# Altium project MCU099_LP-MSPM0L1306.PrjPcb (part 1 of 3)
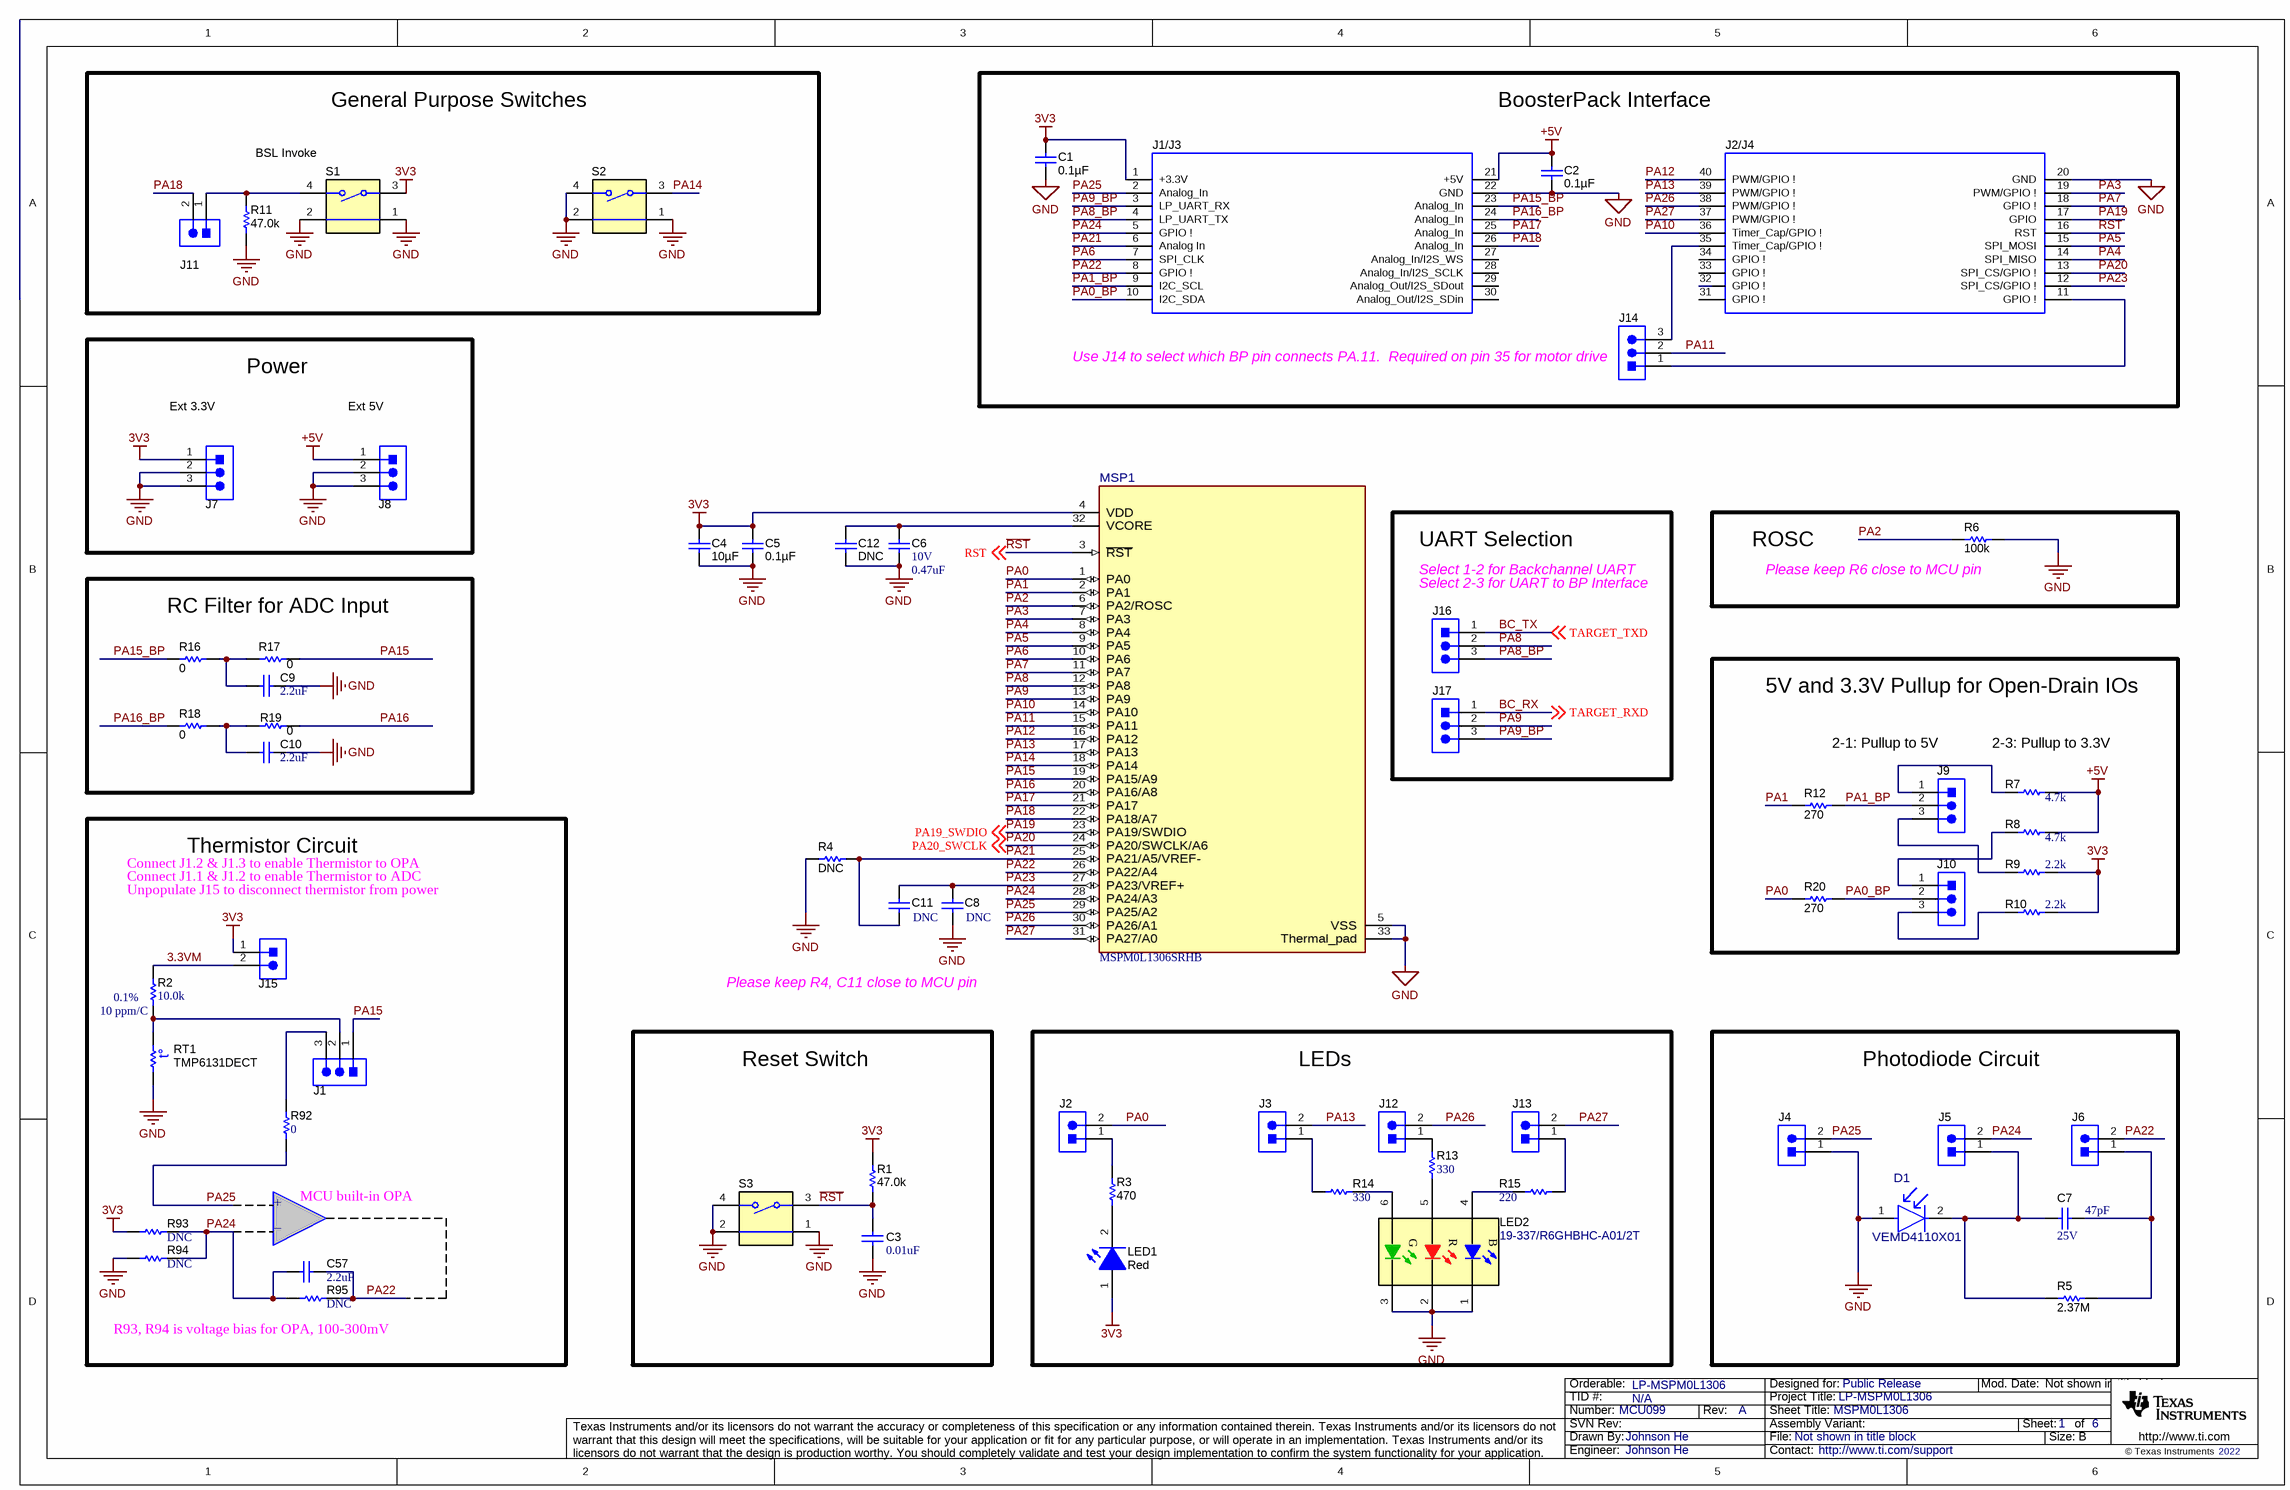
[diagram p0: MCU099_01_MSPM0L1306_Target_Device.SchDoc]
TID: N/A; TechSupport: http://www.ti.com/support; SCH_Rev: A; PRJ_Title: LP-MSPM0L1306; PRJ_Number: MCU099; PRJ_Engineer: Johnson He; PRJ_Customer: Public Release; PCB_Rev: A; PCB_Layout: Johnson He; EVM_orderable: LP-MSPM0L1306; CopyrightYear: 2022
6 sheets, 214 parts. Net scope: global (net labels, ports and power ports of the same name join across sheets).
Board file: MCU099_MSPM0L1306_PCB.PcbDoc
Sheets:
  MCU099_01_MSPM0L1306_Target_Device.SchDoc
  MCU099_02_XDS110_Debug_Probe.SchDoc
  MCU099_03_XDS110-ET_EnergyTrace.SchDoc
  MCU099_04_XDS110_Target_Interface.SchDoc
  MCU099_05_XDS110-ET_USB_Power.SchDoc
  MCU099_06_Hardware.SchDoc

## Sheet MCU099_01_MSPM0L1306_Target_Device.SchDoc: MSPM0L1306
size 431 x 279 mm; Date: Not shown in title block; ApprovedBy: Not shown in title block; CheckedBy: Not shown in title block; Author: Not shown in title block; CompanyName: Not shown in title block; DrawnBy: Johnson He; Engineer: Not shown in title block; Organization: Not shown in title block; Address1: Not shown in title block; Address2: Not shown in title block; Address3: Not shown in title block; Address4: Not shown in title block; DocumentNumber: 1; Revision: Use project parameter SCH_Rev; SheetNumber: 1; SheetTotal: 6; PageSetup: Record=PageOptions|CenterHorizontal=True|CenterVertical=True|PrintScale=1.00|XCorrection=1.00|YCorrection=1.00|PrintKind=0|BorderSize=5000000|LeftOffset=0|BottomOffset=0|Orientation=2|PaperLength=1000|PaperWidth=1000|Scale=100|PaperSource=15|PrintQuality=600|MediaType=1|DitherType=10|PaperKind=Letter|PrintScaleMode=1; CurrentTime: Not shown in title block; CurrentDate: Not shown in title block; Time: Not shown in title block; DocumentFullPathAndName: Not shown in title block; DocumentName: Not shown in title block; ModifiedDate: Not shown in title block; ImagePath: Not shown in title block

### Parts
C1  ValueDisplayed: 0.1µF  [0603]  (hidden comment: CL10A104KA8NNNC)
C2  ValueDisplayed: 0.1µF  [0603]  (hidden comment: CL10A104KA8NNNC)
C3  ValueDisplayed: 0.01uF  [0402]  (hidden comment: 885012205031)
C4  ValueDisplayed: 10µF  [0603]  (hidden comment: GRM188R61C106KAALD)
C5  ValueDisplayed: 0.1µF  [0603]  (hidden comment: CL10A104KA8NNNC)
C6  VDC_V: 10V  ValueDisplayed: 0.47uF  [0603]  (hidden comment: C0603C474K8PACTU)
C7  VDC_V: 25V  ValueDisplayed: 47pF  [0402]  (hidden comment: GRM1555C1E470JA01D)
C8  ValueDisplayed: DNC  [0603]  (hidden comment: C1608X5R1A105K080AC)  (no BOM)
C9  ValueDisplayed: 2.2uF  [0603]  (hidden comment: C0603C225K8PACTU)  (no BOM)
C10  ValueDisplayed: 2.2uF  [0603]  (hidden comment: C0603C225K8PACTU)  (no BOM)
C11  ValueDisplayed: DNC  [0603]  (hidden comment: C1608X5R1A105K080AC)  (no BOM)
C12  ValueDisplayed: DNC  [0603]  (hidden comment: CL10A104KA8NNNC)  (no BOM)
C57  ValueDisplayed: 2.2uF  [0603]  (hidden comment: C0603C225K8PACTU)  (no BOM)
D1  VEMD4110X01  [FP-VEMD4110X01_0805-MFG]
J1  PEC03SAAN  [CONN_PEC03SAAN]  (value not drawn)
J1/J3  SSQ-110-03-T-D  [BoosterPack_40pin_J1J3]  (value not drawn)
J2  TSW-102-07-G-S  [TSW-102-07-G-S]  (value not drawn)
J2/J4  SSQ-110-03-T-D  [BoosterPack_40pin_J2J4]  (value not drawn)
J3  TSW-102-07-G-S  [TSW-102-07-G-S]  (value not drawn)
J4  TSW-102-07-G-S  [TSW-102-07-G-S]  (value not drawn)
J5  TSW-102-07-G-S  [TSW-102-07-G-S]  (value not drawn)
J6  TSW-102-07-G-S  [TSW-102-07-G-S]  (value not drawn)
J7  PEC03SAAN  [PEC03SAAN_Launchpad_3V3]  (value not drawn)
J8  PEC03SAAN  [PEC03SAAN_Launchpad_5V0]  (value not drawn)
J9  PEC03SAAN  [CONN_PEC03SAAN]  (value not drawn)
J10  PEC03SAAN  [CONN_PEC03SAAN]  (value not drawn)
J11  TSW-102-07-G-S  [TSW-102-07-G-S]  (value not drawn)
J12  TSW-102-07-G-S  [TSW-102-07-G-S]  (value not drawn)
J13  TSW-102-07-G-S  [TSW-102-07-G-S]  (value not drawn)
J14  PEC03SAAN  [CONN_PEC03SAAN]  (value not drawn)
J15  90120-0122  [CONN_90120-0122]  (value not drawn)
J16  PEC03SAAN  [CONN_PEC03SAAN]  (value not drawn)
J17  PEC03SAAN  [CONN_PEC03SAAN]  (value not drawn)
LED1  value Red  [1111C_Red]  (hidden comment: BR1111C-TR)
LED2  19-337/R6GHBHC-A01/2T  [19-337_RGB]
MSP1  MSPM0L1306SRHB  [RHB0032N-MFG]
R1  ValueDisplayed: 47.0k  [0402]  (hidden comment: RC0402FR-0747KL)
R2  Tolerance_%: 0.1%  TempCo: 10 ppm/C  ValueDisplayed: 10.0k  [ERA3A]  (hidden comment: ERA3ARB103V)
R3  ValueDisplayed: 470  [0402]  (hidden comment: RC0402FR-07470RL)
R4  ValueDisplayed: DNC  [0603]  (hidden comment: MCT06030Z0000ZP500)  (no BOM)
R5  ValueDisplayed: 2.37M  [0603]  (hidden comment: CRCW06032M37FKEA)
R6  ValueDisplayed: 100k  [0402]  (hidden comment: RG1005P-104-B-T5)
R7  ValueDisplayed: 4.7k  [0603]  (hidden comment: RC0603JR-074K7L)
R8  ValueDisplayed: 4.7k  [0603]  (hidden comment: RC0603JR-074K7L)
R9  ValueDisplayed: 2.2k  [0603]  (hidden comment: RC0603JR-0710KL)
R10  ValueDisplayed: 2.2k  [0603]  (hidden comment: RC0603JR-0710KL)
R11  ValueDisplayed: 47.0k  [0402]  (hidden comment: RC0402FR-0747KL)
R12  ValueDisplayed: 270  [0603]  (hidden comment: RC0603JR-07270RL)
R13  ValueDisplayed: 330  [0402]  (hidden comment: CRCW0402330RJNED)
R14  ValueDisplayed: 330  [0402]  (hidden comment: CRCW0402330RJNED)
R15  ValueDisplayed: 220  [0402]  (hidden comment: CRCW0402220RJNED)
R16  ValueDisplayed: 0  [0603]  (hidden comment: MCT06030Z0000ZP500)
R17  ValueDisplayed: 0  [0603]  (hidden comment: MCT06030Z0000ZP500)
R18  ValueDisplayed: 0  [0603]  (hidden comment: MCT06030Z0000ZP500)
R19  ValueDisplayed: 0  [0603]  (hidden comment: MCT06030Z0000ZP500)
R20  ValueDisplayed: 270  [0603]  (hidden comment: RC0603JR-07270RL)
R92  ValueDisplayed: 0  [0603]  (hidden comment: RC0603JR-070RL)
R93  ValueDisplayed: DNC  [0603]  (hidden comment: RC0603JR-070RL)  (no BOM)
R94  ValueDisplayed: DNC  [0603]  (hidden comment: RC0603JR-070RL)  (no BOM)
R95  ValueDisplayed: DNC  [0603]  (hidden comment: RC0603JR-070RL)  (no BOM)
RT1  TMP6131DECT  [DEC0002A]
S1  1188E-1K2-V-TR  [SW_1188E]  (value not drawn)
S2  1188E-1K2-V-TR  [SW_1188E]  (value not drawn)
S3  1188E-1K2-V-TR  [SW_1188E]  (value not drawn)

### Blocks framed on the sheet
General Purpose Switches: J11 R11 S1 S2
BoosterPack Interface: C1 C2 J1/J3 J2/J4 J14
Power: J7 J8
UART Selection: J16 J17
ROSC: R6
RC Filter for ADC Input: C9 C10 R16-R19
5V and 3.3V Pullup for Open-Drain IOs: J9 J10 R7-R10 R12 R20
Thermistor Circuit: C57 J1 J15 R2 R92-R95 RT1
Reset Switch: C3 R1 S3
LEDs: J2 J3 J12 J13 LED1 LED2 R3 R13-R15
Photodiode Circuit: C7 D1 J4-J6 R5

### Nets
3V3: C1.1 C4.1 C5.1 J1/J3.1(+3.3V) J7.1 J15.1 LED1.1(A) MSP1.4(VDD) R1.2 R9.2 R10.2 R93.1 S1.3
+5V: C2.1 J1/J3.21(+5V) J8.1 R7.2 R8.2
GND: C1.2 C2.2 C3.2 C4.2 C5.2 C6.2 C8.2 C9.2 C10.2 C12.2 D1.1(ANODE) J1/J3.22(GND) J2/J4.20(GND) J4.1 J7.2 J7.3 J8.2 J8.3 LED2.1(K) LED2.2(K) LED2.3(K) MSP1.5(VSS) MSP1.33(Thermal_pad) R4.1 R6.2 R11.1 R94.1 RT1.1 S1.1 S1.2 S2.1 S2.2 S2.4 S3.1 S3.2 S3.4
3.3VM: J15.2 R2.2
BC_RX: J17.1 ; off-sheet TARGET_RXD  [also labelled TARGET_RXD]
BC_TX: J16.1 ; off-sheet TARGET_TXD  [also labelled TARGET_TXD]
PA0: J2.2 MSP1.1(PA0) R20.1
PA0_BP: J1/J3.10(I2C_SDA) J10.2 R20.2
PA1: MSP1.2(PA1) R12.1
PA1_BP: J1/J3.9(I2C_SCL) J9.2 R12.2
PA2: MSP1.6(PA2/ROSC) R6.1
PA3: J2/J4.19(PWM/GPIO_!) MSP1.7(PA3)
PA4: J2/J4.14(SPI_MISO) MSP1.8(PA4)
PA5: J2/J4.15(SPI_MOSI) MSP1.9(PA5)
PA6: J1/J3.7(SPI_CLK) MSP1.10(PA6)
PA7: J2/J4.18(GPIO_!) MSP1.11(PA7)
PA8: J16.2 MSP1.12(PA8)
PA8_BP: J1/J3.4(LP_UART_TX) J16.3
PA9: J17.2 MSP1.13(PA9)
PA9_BP: J1/J3.3(LP_UART_RX) J17.3
PA10: J2/J4.36(Timer_Cap/GPIO_!) MSP1.14(PA10)
PA11: J14.2 MSP1.15(PA11)
PA12: J2/J4.40(PWM/GPIO_!) MSP1.16(PA12)
PA13: J2/J4.39(PWM/GPIO_!) J3.2 MSP1.17(PA13)
PA14: MSP1.18(PA14) S2.3
PA15: J1.1 MSP1.19(PA15/A9) R17.2
PA15_BP: J1/J3.23(Analog_In) R16.1
PA16: MSP1.20(PA16/A8) R19.2
PA16_BP: J1/J3.24(Analog_In) R18.1
PA17: J1/J3.25(Analog_In) MSP1.21(PA17)
PA18: J1/J3.26(Analog_In) J11.2 MSP1.22(PA18/A7)
PA19: J2/J4.17(GPIO) MSP1.23(PA19/SWDIO) ; off-sheet PA19_SWDIO  [also labelled PA19_SWDIO]
PA20: J2/J4.13(SPI_CS/GPIO_!) MSP1.24(PA20/SWCLK/A6) ; off-sheet PA20_SWCLK  [also labelled PA20_SWCLK]
PA21: C11.2 J1/J3.6(Analog_In) MSP1.25(PA21/A5/VREF-) R4.2
PA22: C57.2 J1/J3.8(GPIO_!) J6.2 MSP1.26(PA22/A4) R95.2
PA23: C8.1 C11.1 J2/J4.12(SPI_CS/GPIO_!) MSP1.27(PA23/VREF+)
PA24: C57.1 J1/J3.5(GPIO_!) J5.2 MSP1.28(PA24/A3) R93.2 R94.2 R95.1
PA25: J1/J3.2(Analog_In) J4.2 MSP1.29(PA25/A2) R92.1
PA26: J2/J4.38(PWM/GPIO_!) J12.2 MSP1.30(PA26/A1)
PA27: J2/J4.37(PWM/GPIO_!) J13.2 MSP1.31(PA27/A0)
~{RST}: C3.1 J2/J4.16(RST) MSP1.3(~{RST}) R1.1 S3.3 ; off-sheet RST  [also labelled RST]
NetC6_1: C6.1 C12.1 MSP1.32(VCORE)
NetC7_1: C7.1 D1.2(CATHODE) J5.1 R5.1
NetC7_2: C7.2 J6.1 R5.2
NetC9_1: C9.1 R16.2 R17.1
NetC10_1: C10.1 R18.2 R19.1
NetJ1_2: J1.2 R2.1 RT1.2
NetJ1_3: J1.3 R92.2
NetJ2/J4_11: J2/J4.11(GPIO_!) J14.1
NetJ2/J4_35: J2/J4.35(Timer_Cap/GPIO_!) J14.3
NetJ2_1: J2.1 R3.1
NetJ3_1: J3.1 R14.1
NetJ9_1: J9.1 R7.1
NetJ9_3: J9.3 R9.1
NetJ10_1: J10.1 R8.1
NetJ10_3: J10.3 R10.1
NetJ11_1: J11.1 R11.2 S1.4
NetJ12_1: J12.1 R13.2
NetJ13_1: J13.1 R15.2
NetLED1_2: LED1.2(K) R3.2
NetLED2_4: LED2.4(A) R15.1
NetLED2_5: LED2.5(A) R13.1
NetLED2_6: LED2.6(A) R14.2

Not connected (* = marked no-connect by the designer): J1/J3 27(Analog_In/I2S_WS) 28(Analog_In/I2S_SCLK) 29(Analog_Out/I2S_SDout) 30(Analog_Out/I2S_SDin); J2/J4 31(GPIO_!) 32(GPIO_!) 33(GPIO_!) 34(GPIO_!)

### Notes on the sheet
- BSL Invoke
- (near J14) Use J14 to select which BP pin connects PA.11.  Required on pin 35 for motor drive
- (near J7) Ext 3.3V
- (near J8) Ext 5V
- Select 1-2 for Backchannel UART
- (near R6) Please keep R6 close to MCU pin
- Select 2-3 for UART to BP Interface
- 2-1: Pullup to 5V
- (near R7) 2-3: Pullup to 3.3V
- Connect J1.1 & J1.2 to enable Thermistor to ADC
- Connect J1.2 & J1.3 to enable Thermistor to OPA
- Unpopulate J15 to disconnect thermistor from power
- Please keep R4, C11 close to MCU pin
- _
- +
- MCU built-in OPA
- (near R95) R93, R94 is voltage bias for OPA, 100-300mV
- Drawn By:
- SVN Rev:
- Number:
- TID #:
- Orderable:
- Rev:
- Sheet Title:
- File:
- Project Title:
- Designed for:
- Assembly Variant:
- Mod. Date:
- Sheet:
- Size:
- of
- B
- http://www.ti.com
- Texas Instruments and/or its licensors do not warrant the accuracy or completeness of this specification or any information contained therein. Texas Instruments and/or its licensors do not warrant that this design will meet the specifications, will be suitable for your application or fit for any particular purpose, or will operate in an implementation. Texas Instruments and/or its licensors do not warrant that the design is production worthy. You should completely validate and test your design implementation to confirm the system functionality for your application.
- Engineer:
- Contact:
- © Texas Instruments
- (in symbol CMP-0074720-2) G; R; B
- (in symbol CMP-0084565-1) t°

### Library data of the parts
C1 C2 C5 C12 = CMP-0085577-2: CAP, CERM, 0.1 µF, 25 V,+/- 10%, X5R, 0603; Manufacturer: Samsung Electro-Mechanics; SizeZ_mm: 1; AEC Qualified: N; SizeY_mm: 0.8; Green_REACh: Incomplete; SizeArea_mm2: 1.28; Green_Lifecycle: Active; SizeX_mm: 1.6; AEC Category: Q200; TaMin_C: -55°C; SizeAreaWB_mm2: 4.68; Cap_F: 100nF; U/M: EA; TaMax_C: 85°C; Value: 0.1uF; Value2: 25V; Tolerance_%: 10%; MountType: SMT; PackageReference: 0603; ComponentLink1URL: http://www.samsungsem.com/kr/support/product-search/mlcc/__icsFiles/afieldfile/2018/06/20/CL10A104KA8NNNC.pdf; Green_EU RoHS-2: Incomplete; Cap_Case: 0603; ComponentLink1Description: Datasheet link; TempCo: X5R; Technology: Ceramic; Green_EU RoHS: Passed; Polarized: N; AEC Grade: N/A; PartNumber: CL10A104KA8NNNC; CompType: Capacitor; RoHS: Y
C3 = CMP-0006227-2: CAP, CERM, 0.01 uF, 16 V, +/- 10%, X7R, 0402; Manufacturer: Wurth Elektronik; TaMin_C: -55°C; Polarized: N; SizeAreaWB_mm2: 3; Value1: Unknown; U/M: EA; Value: 0.01uF; TaMax_C: 125°C; SizeZ_mm: 0.6; SizeX_mm: 1; SizeY_mm: 0.5; Value2: 16V; Cap_F: 10nF; AEC Category: Q200; Publisher: Texas Instruments; TempCo: X7R; Published: 2008-06-19; RoHS: Y; MountType: SMT; Supplier 1: Mouser; PackageReference: 0402; Tolerance_%: 10%; Cap_Case: 0402; SizeArea_mm2: 0.5; CompType: Capacitor; LatestRevisionDate: 2017-03-09; PartNumber: 885012205031; AEC Qualified: N; VDC_V: 16V; ComponentLink1Description: Datasheet link; Supplier Part Number 1: 710-885012205031; Technology: Ceramic; ComponentLink1URL: http://katalog.we-online.de/pbs/datasheet/885012205031.pdf; AEC Grade: N/A
C4 = CMP-0086225-1: CAP, CERM, 10 µF, 16 V,+/- 10%, X5R, 0603; Manufacturer: MuRata; SizeZ_mm: 1; SizeX_mm: 1.6; SizeArea_mm2: 1.28; U/M: EA; AEC Category: Q200; SizeY_mm: 0.8; Polarized: N; TaMax_C: 85°C; Value: 10uF; SizeAreaWB_mm2: 4.68; TaMin_C: -55°C; Value2: 16V; TempCo: X5R; ComponentLink1URL: https://search.murata.co.jp/Ceramy/image/img/A01X/G101/ENG/GRM188R61C106KAAL-01.pdf; Cap_F: 10µF; Supplier 2: Newark; ComponentLink1Description: Datasheet link; Supplier 1: Digi-Key; Cap_Case: 0603; Supplier Part Number 1: 490-10728-1-ND; AEC Grade: N/A; CompType: Capacitor; Technology: Ceramic; PackageReference: 0603; RoHS: Y; MountType: SMT; Supplier 3: Mouser; AEC Qualified: N; Tolerance_%: 10%; PartNumber: GRM188R61C106KAALD
C6 = CMP-0006945-5: CAP, CERM, 0.47 uF, 10 V, +/- 10%, X5R, 0603; Manufacturer: Kemet; TaMin_C: -55°C; Polarized: N; SizeAreaWB_mm2: 4.68; Value1: Unknown; U/M: EA; Value: 0.47uF; TaMax_C: 85°C; SizeZ_mm: 1; SizeX_mm: 1.6; SizeY_mm: 0.8; SizeArea_mm2: 1.28; Cap_F: 470nF; AEC Category: Q200; Supplier Part Number 2: 80-C0603C474K8P; Publisher: Texas Instruments; Supplier 2: Mouser; TempCo: X5R; Published: 2008-06-19; RoHS: Y; MountType: SMT; Supplier 1: Digi-Key; PackageReference: 0603; Tolerance_%: 10%; Cap_Case: 0603; Value2: 10V; CompType: Capacitor; LatestRevisionDate: 2017-03-09; PartNumber: C0603C474K8PACTU; AEC Qualified: ?; ComponentLink1Description: Datasheet link; Supplier Part Number 1: 399-3114-1-ND; Technology: Ceramic; ComponentLink1URL: http://www.kemet.com/kemet/web/homepage/kechome.nsf/vapubfiles/F3102_Y5V.pdf/$file/F3102_Y5V.pdf
C7 = CMP-0006388-2: CAP, CERM, 47 pF, 25 V, +/- 5%, C0G/NP0, 0402; Manufacturer: MuRata; TaMin_C: -55°C; Polarized: N; SizeAreaWB_mm2: 3; Value1: Unknown; U/M: EA; Value: 47pF; TaMax_C: 125°C; SizeZ_mm: 0.6; SizeX_mm: 1; SizeY_mm: 0.5; AEC Category: Q200; Publisher: Texas Instruments; TempCo: C0G/NP0; Published: 2008-06-19; RoHS: Y; MountType: SMT; Supplier 1: Mouser; PackageReference: 0402; Tolerance_%: 5%; Cap_Case: 0402; Value2: 25V; SizeArea_mm2: 0.5; CompType: Capacitor; LatestRevisionDate: 2017-03-09; PartNumber: GRM1555C1E470JA01D; AEC Qualified: ?; Cap_F: 47pF; ComponentLink1Description: Datasheet link; Supplier Part Number 1: 81-GRM1555C1E470JA1D; Technology: Ceramic; ComponentLink1URL: http://search.murata.co.jp/Ceramy/PnsearchViewAction.do?HnOFG=ON&HnNFG=ON&SEL_CNT=50&sLang=en&sKey=GRM1555C1E470JA01D&x=9&y=9&search=startwith
C8 C11 = CMP-0007002-5: CAP, CERM, 1 uF, 10 V, +/- 10%, X5R, 0603; Manufacturer: TDK; TaMin_C: -55°C; Polarized: N; SizeAreaWB_mm2: 4.68; Value1: Unknown; U/M: EA; Value: 1uF; TaMax_C: 85°C; SizeZ_mm: 1; SizeX_mm: 1.6; SizeY_mm: 0.8; Value2: 10V; SizeArea_mm2: 1.28; Cap_F: 1µF; AEC Category: Q200; Supplier Part Number 2: 05X9843; Publisher: Texas Instruments; Supplier 2: Newark; Supplier Part Number 3: 810-C1608X5R1A105K; TempCo: X5R; Supplier 3: Mouser; Published: 2008-06-19; RoHS: Y; MountType: SMT; Supplier 1: Digi-Key; PackageReference: 0603; Tolerance_%: 10%; Cap_Case: 0603; CompType: Capacitor; LatestRevisionDate: 2017-03-09; PartNumber: C1608X5R1A105K080AC; AEC Qualified: N; VDC_V: 10V; ComponentLink1Description: Datasheet link; Supplier Part Number 1: 445-1321-1-ND; Technology: Ceramic; ComponentLink1URL: https://product.tdk.com/info/en/catalog/datasheets/mlcc_commercial_general_en.pdf; AEC Grade: N/A
C9 C10 C57 = CMP-0006906-5: CAP, CERM, 2.2 uF, 10 V, +/- 10%, X5R, 0603; Manufacturer: Kemet; TaMin_C: -55°C; Polarized: N; SizeAreaWB_mm2: 4.68; Value1: Unknown; U/M: EA; Value: 2.2uF; TaMax_C: 85°C; SizeZ_mm: 1; SizeX_mm: 1.6; SizeY_mm: 0.8; Value2: 10V; SizeArea_mm2: 1.28; Cap_F: 2.2µF; AEC Category: Q200; Publisher: Texas Instruments; TempCo: X5R; Published: 2008-06-19; RoHS: Y; MountType: SMT; Supplier 1: Digi-Key; PackageReference: 0603; Tolerance_%: 10%; Cap_Case: 0603; CompType: Capacitor; LatestRevisionDate: 2017-03-09; PartNumber: C0603C225K8PACTU; AEC Qualified: ?; VDC_V: 10V; ComponentLink1Description: Datasheet link; Supplier Part Number 1: 399-4911-1-ND; Technology: Ceramic; ComponentLink1URL: http://www.kemet.com/kemet/web/homepage/kechome.nsf/vapubfiles/F3102_Y5V.pdf/$file/F3102_Y5V.pdf; Supplier 2: Mouser; Supplier 3: Farnell; Supplier Part Number 2: 80-C0603C225K8P; Supplier Part Number 3: 1108322
D1 = CMP-0093192-1: Photodiode PIN Chip 910nm Automotive 2-Pin Case 0805(2012Metric) T/R; Manufacturer: Vishay; TaMax_C: +110°C; Reverse Breakdown Voltage: 20V; AEC Qualified: Yes; TaMin_C: -40°C; Angle: 110°; Forward Current: 50mA; Vf_V: 1.1V; AEC Grade: Grade 2; Dark Current: 0.001uA; SizeZ_mm: 0.8mm; PartNumber: VEMD4110X01; LambdaD: 910nm; helpURL: https://upverter.com/upn/revision/01c27b98662013f0/; Datasheet Path: datasheets/Diode-VEMD4110X01.pdf; Operating Temperature Range: -40°C to +110°C; datasheet: https://www.vishay.com/docs/84910/vemd4110x01.pdf; Sensor Output: Photodiode; ComponentLink1Description: Datasheet; Digikey Description: PHOTO PIN DIODE IN LOW PROFILE 0; Part Number: VEMD4110X01; PackageReference: 0805; Digikey Part Number: 751-VEMD4110X01CT-ND; Lead Free: Yes; Mouser Part Number: 78-VEMD4110X01; ComponentLink1URL: https://www.vishay.com/docs/84910/vemd4110x01.pdf; RoHS: TRUE
J1 J7-J10 J14 J16 J17 = CMP-0002338-1: Header, 100mil, 3x1, Tin, TH; Manufacturer: Sullins Connector Solutions; CNHeader: TRUE; Current_A: 3A; Green_Lifecycle: Not Set; Shrouded: N; Gender: Male; Green_REACh: Incomplete; Voltage_V: 1.8kV; Row_Count: 1; Pitch_mm: 2.54; CT: FALSE; Cert_UL: Y; ComponentLink1URL: http://www.sullinscorp.com/catalogs/77_PAGE108-109_.100_MALE_HDR.pdf; ClassName: Header; Publisher: Texas Instruments; Color: Black; RoHS: Y; MountType: TH; Green_EU RoHS-2: Incomplete; Supplier 1: Digi-Key; Green_EU RoHS: Incomplete; PackageReference: Header, 3 PIN, 100mil, Tin; PinCount: 3; CompType: Header; LatestRevisionDate: 26/05/2017; PartNumber: PEC03SAAN; Orientation: Vertical; ComponentLink1Description: Datasheet URL; Supplier Part Number 1: S1012E-03-ND; ContactFinish: Tin
J1/J3 = BoosterPack_40pin_J1J3: Receptacle, 2.54mm, 10x2, Tin, TH; Manufacturer: Samtec; Alternate Manufacturer: Major League Electronics; Alternate PartNumber: CRD-081413-A-G; SymbolCreator: a0412235; Note: Booster Pack 40 pin J1 and J3; SymbolVersion: 2015-10-21; CompType: Receptacle; PartNumber: SSQ-110-03-T-D; RoHS: Y; PackageReference: 10x2 Receptacle; MountType: TH; ComponentLink1Description: Datasheet Link; Publisher: Texas Instruments; LatestRevisionDate: 2017-04-10; Supplier 1: Digi-Key; Supplier Part Number 1: SAM1204-10-ND
J2-J6 J11-J13 = CMP-0075405-2: Header, 100mil, 2x1, Gold, TH; Manufacturer: Samtec; Pitch_mm: 2.54; Cert_VDE: N; Gender: Male; Cert_CSA: Y; Voltage_V: 550V; Green_REACh: Passed; Current_A: 6.3A; Green_Lifecycle: Active; Row_Count: 1; ComponentLink1Description: Datasheet URL; RoHS: Y; Supplier 1: Digi-Key; Cert_UL: Y; Orientation: Vertical; Green_EU RoHS: Passed; PackageReference: 2x1 Header; Color: Black; PartNumber: TSW-102-07-G-S; PinCount: 2; ContactFinish: Gold; Cert_CULUS: N; Shrouded: N; ClassName: Header; ComponentLink1URL: http://samtec.com/ftppub/pdf/TSW_TH.PDF; CompType: Header; MountType: TH; Supplier Part Number 1: SAM1029-02-ND; Green_EU RoHS-2: Passed
J2/J4 = BoosterPack_40pin_J2J4: Receptacle, 2.54mm, 10x2, Tin, TH; Manufacturer: Samtec; Alternate Manufacturer: Major League Electronics; Alternate PartNumber: CRD-081413-A-G; SymbolCreator: a0412235; Note: Booster Pack 40 pin J2 and J4; SymbolVersion: 2015-10-21; CompType: Receptacle; PartNumber: SSQ-110-03-T-D; RoHS: Y; PackageReference: 10x2 Receptacle; MountType: TH; ComponentLink1Description: Datasheet Link; Publisher: Texas Instruments; LatestRevisionDate: 2017-04-10; Supplier 1: Digi-Key; Supplier Part Number 1: SAM1204-10-ND
J15 = CMP-0055312-1: Header, 100mil, 2x1, Tin, TH; Manufacturer: Molex; CNHeader: TRUE; Green_Lifecycle: Active; Green_REACh: Passed; CT: FALSE; ComponentLink1URL: http://www.molex.com/pdm_docs/sd/901200122_sd.pdf; ClassName: Header; Supplier Part Number 2: 19M8215; Publisher: Texas Instruments; Supplier 2: Newark; Supplier Part Number 3: 538-90120-0122; Supplier 3: Mouser; RoHS: Y; MountType: TH; Green_EU RoHS-2: Passed; Supplier 1: Digi-Key; Green_EU RoHS: Passed; PackageReference: Header 2x1; CompType: Header; LatestRevisionDate: 26/05/2017; PartNumber: 90120-0122; ComponentLink1Description: Datasheet URL; Supplier Part Number 1: WM8072-ND
LED1 = CMP-0002972-3: LED, Red, SMD; Manufacturer: Stanley Electric Co., LTD; Power_TotalModule: 57.5mW; Vr_V: 4V; Value1: 0.0575W; Ir_A: 100µA; Io_A: 20mA; Value2: 1.7V; Tjmax_C: 85°C; RoHS: Y; Type: ?; ComponentLink1URL: https://sps06.itg.ti.com/sites/KMS/crossdivteams/altium/docs/ComponentDatasheets/BR1111C-TR.pdf; PackageReference: 1.6x0.8mm; PartNumber: BR1111C-TR; MountType: SMT; ComponentLink1Description: Datasheet link; CompType: LED; Color: Red; Vf_V: 1.7V
LED2 = CMP-0074720-2: LED, RGB, TH; Manufacturer: Everlight; Vf_V: 3.8V; Ir_A: 50µA; Io_A: 25mA; Vr_V: 5V; Angle: 120.0; Tjmax_C: 85°C; Value: RGB; PackageReference: 1.6x1.6mm; MountType: SMT; PartNumber: 19-337/R6GHBHC-A01/2T; RoHS: Y; Type: ?; Color: RGB; ComponentLink1URL: http://www.everlight.com/file/ProductFile/19-337-R6GHBHC-A01-2T.pdf; CompType: LED; Value2: 3.8V; ComponentLink1Description: Datasheet link
MSP1 = CMP-0093968-1: MSPM0L130x Mixed-Signal Microcontrollers; Manufacturer: Texas Instruments; Number Of Pwm Channels: 8; TJmax_C: +130°C; Interface: I2C,SPI,UART,LIN,IrDA,SMBus; Number Of I2C Channels: 2; Memory Size: 64KBytes; Core Architecture: ARM Cortex-M0+; Number Of Spi Channels: 1; Min Supply Voltage: 1.62V; Ram Size: 4KBytes; Data Bus Width: 32bits; TaMax_C: +125°C; Frequency_Fixed: 32MHz; Memory Type: FLASH; Number Of Adc Channels: 10; Standoff Height: 0mm; AEC Qualified: No; Number Of I/Os: 28; TaMin_C: -40°C; SizeZ_mm: 1mm; Max Supply Voltage: 3.6V; Number Of Timers/Counters: 4; PackageReference: VQFN32; Operating Temperature Range: -40°C to +125°C; Datasheet Path: datasheets/IC-MSPM0L1306SRHB.pdf; Part Number: MSPM0L1306SRHB; PartNumber: MSPM0L1306SRHB; Number Of Uart Channels: 2; RoHS: UNKNOWN; helpURL: https://upverter.com/upn/revision/6d805f7362bc03c2/; Number Of Cores: 1; Number Of A/D Converters: 1
R1 R11 = CMP-0026737-1: RES, 47.0 k, 1%, 0.0625 W, 0402; Manufacturer: Yageo America; Power_W: 62.5mW; TempCo: 100 ppm/C; Value_Code: 47k0; U/M: EA; Value: 47.0k; Res_ohm: 47k; SizeX_mm: 1; SizeY_mm: 0.5; SizeZ_mm: 0.6; AEC Qualified: N; VDC_V: 50V; AEC Category: Q200; ComponentLink1URL: http://www.yageo.com/documents/recent/PYu-RC0402_51_RoHS_L_6_r.pdf; Supplier Part Number 2: 67R9937; Publisher: Texas Instruments; Supplier 2: Newark; Supplier Part Number 3: 603-RC0402FR-0747KL; Supplier 3: Mouser; Published: 2008-06-26; RoHS: Y; Value1: 1%; MountType: SMT; Supplier 1: Digi-Key; PackageReference: 0402; Tolerance_%: 1%; Value2: 0.0625W; SizeArea_mm2: 0.5; CompType: Resistor; LatestRevisionDate: 2017-03-09; PartNumber: RC0402FR-0747KL; ComponentLink1Description: Datasheet link; AEC Grade: N/A; Supplier Part Number 1: 311-47.0KLRCT-ND; Technology: Thick Film
R2 = CMP-0080084-1: RES, 10.0 k, 0.1%, 0.1 W, AEC-Q200 Grade 0, 1.6x0.8mm; Manufacturer: Panasonic; Value_Code: 10k0; SizeAreaWB_mm2: 4.68; SizeArea_mm2: 1.28; AEC Qualified: Y; AEC Category: Q200; Res_ohm: 10k; Value: 10.0k; SizeZ_mm: 0.55; AEC Grade: 0; Power_W: 100mW; VDC_V: 150V; SizeY_mm: 0.8; Value2: 0.1W; SizeX_mm: 1.6; ComponentLink1Description: Datasheet link; RoHS: Y; Supplier Part Number 3: 667-ERA-3ARB103V; Supplier 1: Digi-Key; PackageReference: 1.6x0.8mm; Technology: Thin Film; PartNumber: ERA3ARB103V; Supplier Part Number 2: 62W8891; Supplier 2: Newark; ComponentLink1URL: https://industrial.panasonic.com/cdbs/www-data/pdf/RDM0000/AOA0000C307.pdf; Value1: 0.1%; CompType: Resistor; MountType: SMT; Supplier Part Number 1: P10KBDCT-ND; Supplier 3: Mouser
R3 = CMP-0026736-1: RES, 470, 1%, 0.063 W, 0402; Manufacturer: Yageo America; Power_W: 63mW; TempCo: 100 ppm/C; Value_Code: 470R; U/M: EA; Value: 470; SizeX_mm: 1; SizeY_mm: 0.5; SizeZ_mm: 0.6; Value2: 0.063W; AEC Qualified: N; VDC_V: 50V; AEC Category: Q200; ComponentLink1URL: http://www.yageo.com/documents/recent/PYu-RC_Group_51_RoHS_L_04.pdf; Supplier Part Number 2: 67R9940; Publisher: Texas Instruments; Supplier 2: Newark; Supplier Part Number 3: 603-RC0402FR-07470RL; Supplier 3: Mouser; Published: 2008-06-26; RoHS: Y; Value1: 1%; MountType: SMT; Supplier 1: Digi-Key; PackageReference: 0402; Tolerance_%: 1%; Res_ohm: 470; SizeArea_mm2: 0.5; CompType: Resistor; LatestRevisionDate: 2017-03-09; PartNumber: RC0402FR-07470RL; ComponentLink1Description: Datasheet link; AEC Grade: N/A; Supplier Part Number 1: 311-470LRCT-ND; Technology: Thick Film
R4 R16-R19 = CMP-0025884-2: RES, 0, 5%, 0.125 W, 0603; Manufacturer: Vishay/Beyschlag; Power_W: 125mW; TempCo: ppm/C; Value_Code: 0000; U/M: EA; Value: 0; EIA_Code: E24; SizeX_mm: 1.6; SizeY_mm: 0.8; SizeZ_mm: 1; Value2: 0.125W; SizeArea_mm2: 1.28; AEC Qualified: N; AEC Category: Q200; Supplier Part Number 2: 96Y9454; Publisher: Texas Instruments; Supplier 2: Newark; Supplier Part Number 3: 594-MCT06030Z0000ZP5; Supplier 3: Mouser; Published: 2008-06-26; RoHS: Y; Value1: 5%; MountType: SMT; Supplier 1: Digi-Key; PackageReference: 0603; Tolerance_%: 5%; Res_ohm: 0; CompType: Resistor; LatestRevisionDate: 2017-03-09; PartNumber: MCT06030Z0000ZP500; ComponentLink1Description: Datasheet link; AEC Grade: N/A; Supplier Part Number 1: MCT0603-0.0-ZZCT-ND; Technology: Thin Film; ComponentLink1URL: http://www.vishay.com/docs/28705/mcx0x0xpro.pdf
R5 = CMP-0022292-4: RES, 2.37 M, 1%, 0.1 W, AEC-Q200 Grade 0, 0603; Manufacturer: Vishay-Dale; Power_W: 100mW; TempCo: 100 ppm/C; Value_Code: 2M37; Value: 2.37Meg; EIA_Code: E96; SizeX_mm: 1.6; SizeY_mm: 0.8; SizeZ_mm: 1; Value2: 0.1W; SizeArea_mm2: 1.28; AEC Qualified: Y; VDC_V: 75V; AEC Category: Q200; AEC Grade: 0; Supplier Part Number 2: 71-CRCW06032M37FKEA; Supplier 2: Mouser; RoHS: E; Value1: 1%; MountType: SMT; Supplier 1: Digi-Key; PackageReference: 0603; Tolerance_%: 1%; Res_ohm: 2.37M; CompType: Resistor; PartNumber: CRCW06032M37FKEA; ComponentLink1Description: Datasheet link; Supplier Part Number 1: 541-2.37MHCT-ND; Technology: Thick Film; ComponentLink1URL: http://www.vishay.com/docs/20035/dcrcwe3.pdf
R6 = CMP-0026815-1: RES, 100 k, 0.1%, 0.063 W, 0402; Manufacturer: Susumu Co Ltd; Power_W: 63mW; TempCo: 25 ppm/C; U/M: EA; Value: 100k; EIA_Code: E192; SizeX_mm: 1; SizeY_mm: 0.5; SizeZ_mm: 0.6; Value2: 0.063W; AEC Category: Q200; ComponentLink1URL: http://www.susumu-usa.com/pdf/RG_Data_Sheet.pdf; Supplier Part Number 2: 85K1460; Publisher: Texas Instruments; Supplier 2: Newark; Supplier Part Number 3: 754-RG1005P-104-B-T5; Supplier 3: Mouser; Published: 2008-06-26; Value_Code: 100k; RoHS: Y; Value1: 0.1%; MountType: SMT; Supplier 1: Digi-Key; PackageReference: 0402; Tolerance_%: 0.1%; Res_ohm: 100k; SizeArea_mm2: 0.5; CompType: Resistor; LatestRevisionDate: 2017-03-09; PartNumber: RG1005P-104-B-T5; AEC Qualified: ?; ComponentLink1Description: Datasheet link; Supplier Part Number 1: RG10P100KBCT-ND; Technology: Thin Film
R7 R8 = CMP-0025927-5: RES, 4.7 k, 5%, 0.1 W, 0603; Manufacturer: Yageo; Power_W: 100mW; TempCo: 100 ppm/C; Value_Code: 4k70; Value: 4.7k; EIA_Code: E24; SizeX_mm: 1.6; SizeY_mm: 0.8; SizeZ_mm: 1; Value2: 0.1W; SizeArea_mm2: 1.28; AEC Qualified: N; VDC_V: 75V; AEC Category: Q200; SizeAreaWB_mm2: 4.68; Supplier Part Number 2: 603-RC0603JR-074K7L; Supplier 2: Mouser; Supplier Part Number 3: 9233466; Supplier 3: Farnell; RoHS: Y; Value1: 5%; MountType: SMT; Supplier 1: Digi-Key; PackageReference: 0603; Tolerance_%: 5%; Res_ohm: 4.7k; CompType: Resistor; PartNumber: RC0603JR-074K7L; ComponentLink1Description: Datasheet link; Supplier Part Number 1: 311-4.7KGRCT-ND; Technology: Thick Film; ComponentLink1URL: http://www.yageo.com/pdf/Pu-RC0603_51_PbFree_L_2.pdf; AEC Grade: N/A
R9 R10 = CMP-0025906-5: RES, 2.2 k, 5%, 0.1 W, 0603; PartNumber: RC0603JR-072K2L; Manufacturer: Yageo; Power_W: 100mW; TempCo: 100 ppm/C; Value_Code: 2k20; Value: 2.2k; EIA_Code: E24; SizeX_mm: 1.6; SizeY_mm: 0.8; SizeZ_mm: 1; Value2: 0.1W; SizeArea_mm2: 1.28; VDC_V: 75V; SizeAreaWB_mm2: 4.68; AEC Qualified: N; AEC Category: Q200; Supplier Part Number 2: 603-RC0603JR-072K2L; Supplier 2: Mouser; Supplier Part Number 3: 9233423; Supplier 3: Farnell; RoHS: Y; Value1: 5%; MountType: SMT; Tolerance_%: 5%; Res_ohm: 2.2k; CompType: Resistor; ComponentLink1Description: Datasheet link; Supplier Part Number 1: 311-2.2KGRCT-ND; ComponentLink1URL: http://www.yageo.com/pdf/Pu-RC0603_51_PbFree_L_2.pdf; Supplier 1: Digi-Key; PackageReference: 0603; Technology: Thick Film; AEC Grade: N/A
R12 R20 = CMP-0025904-5: RES, 270, 5%, 0.1 W, 0603; Manufacturer: Yageo; Power_W: 100mW; TempCo: 100 ppm/C; Value_Code: 270R; Value: 270; EIA_Code: E24; SizeX_mm: 1.6; SizeY_mm: 0.8; SizeZ_mm: 1; Value2: 0.1W; SizeArea_mm2: 1.28; AEC Qualified: N; VDC_V: 75V; AEC Category: Q200; SizeAreaWB_mm2: 4.68; Supplier Part Number 2: 603-RC0603JR-07270RL; Supplier 2: Mouser; Supplier Part Number 3: 9233300; Supplier 3: Farnell; RoHS: Y; Value1: 5%; MountType: SMT; Supplier 1: Digi-Key; PackageReference: 0603; Tolerance_%: 5%; Res_ohm: 270; CompType: Resistor; PartNumber: RC0603JR-07270RL; ComponentLink1Description: Datasheet link; Supplier Part Number 1: 311-270GRCT-ND; Technology: Thick Film; ComponentLink1URL: http://www.yageo.com/pdf/Pu-RC0603_51_PbFree_L_2.pdf; AEC Grade: N/A
R13 R14 = CMP-0026906-1: RES, 330, 5%, 0.063 W, 0402; Manufacturer: Vishay-Dale; Power_W: 63mW; TempCo: 200 ppm/C; Value_Code: 330R; U/M: EA; Value: 330; EIA_Code: E24; SizeX_mm: 1; SizeY_mm: 0.5; SizeZ_mm: 0.6; Value2: 0.063W; VDC_V: 50V; AEC Category: Q200; ComponentLink1URL: http://www.vishay.com/docs/20035/dcrcwe3.pdf; Supplier Part Number 2: 59M6728; Publisher: Texas Instruments; Supplier 2: Newark; Supplier Part Number 3: 71-CRCW0402J-330-E3; Supplier 3: Mouser; Published: 2008-06-26; RoHS: Y; Value1: 5%; MountType: SMT; Supplier 1: Digi-Key; PackageReference: 0402; Tolerance_%: 5%; Res_ohm: 330; SizeArea_mm2: 0.5; CompType: Resistor; LatestRevisionDate: 2017-03-09; PartNumber: CRCW0402330RJNED; AEC Qualified: ?; ComponentLink1Description: Datasheet link; Supplier Part Number 1: 541-330JCT-ND; Technology: Thick Film
R15 = CMP-0026878-1: RES, 220, 5%, 0.063 W, 0402; Manufacturer: Vishay-Dale; Power_W: 63mW; TempCo: 200 ppm/C; Value_Code: 220R; U/M: EA; Value: 220; EIA_Code: E24; SizeX_mm: 1; SizeY_mm: 0.5; SizeZ_mm: 0.6; Value2: 0.063W; VDC_V: 50V; AEC Category: Q200; ComponentLink1URL: http://www.vishay.com/docs/20035/dcrcwe3.pdf; Supplier Part Number 2: 59M6718; Publisher: Texas Instruments; Supplier 2: Newark; Supplier Part Number 3: 71-CRCW0402J-220-E3; Supplier 3: Mouser; Published: 2008-06-26; RoHS: Y; Value1: 5%; MountType: SMT; Supplier 1: Digi-Key; PackageReference: 0402; Tolerance_%: 5%; Res_ohm: 220; SizeArea_mm2: 0.5; CompType: Resistor; LatestRevisionDate: 2017-03-09; PartNumber: CRCW0402220RJNED; AEC Qualified: ?; ComponentLink1Description: Datasheet link; Supplier Part Number 1: 541-220JCT-ND; Technology: Thick Film
R92-R95 = CMP-0025885-5: RES, 0, 5%, 0.1 W, 0603; Manufacturer: Yageo; Power_W: 100mW; TempCo: 200 ppm/C; Value_Code: 0000; Value: 0; EIA_Code: E24; SizeX_mm: 1.6; SizeZ_mm: 1; Value2: 0.1W; SizeArea_mm2: 1.28; AEC Qualified: N; VDC_V: 75V; AEC Category: Q200; SizeY_mm: 0.8; SizeAreaWB_mm2: 4.68; Supplier Part Number 2: 603-RC0603JR-070RL; Supplier 2: Mouser; Supplier Part Number 3: 9233130; Supplier 3: Farnell; RoHS: Y; Value1: 5%; MountType: SMT; Supplier 1: Digi-Key; PackageReference: 0603; Tolerance_%: 5%; Res_ohm: 0; CompType: Resistor; PartNumber: RC0603JR-070RL; ComponentLink1Description: Datasheet link; Supplier Part Number 1: 311-0.0GRCT-ND; Technology: Thick Film; ComponentLink1URL: http://www.yageo.com/pdf/Pu-RC0603_51_PbFree_L_2.pdf; AEC Grade: N/A
RT1 = CMP-0084565-1: Thermistor, DEC0002A (X1SON-2); Alternate Manufacturer: Texas Instruments; Alternate PartNumber: TMP6131DECR; SizeZ_mm: 0.5; CompType: IC; AEC Category: Q200; SizeArea_mm2: 0.6; AEC Qualified: N; SizeX_mm: 1; SizeAreaWB_mm2: 3.2; ComponentLink3Description: Online Datasheet; PackageReference: DEC0002A; ComponentLink2Description: Product Folder; ComponentLink3URL: http://www.ti.com/product/tmp6/datasheet; MountType: SMT; PackageDescription: X1SON-2; ComponentLink2URL: http://www.ti.com/product/tmp6; PartNumber: TMP6131DECT; ComponentLink1URL: http://www.ti.com/lit/ds/symlink/tmp6.pdf; ComponentLink1Description: Datasheet Link; SizeY_mm: 0.6; Manufacturer: Texas Instruments
S1-S3 = CMP-0002328-1: Switch, SPST, 0.05 A, 12 VDC, SMD; Manufacturer: Diptronics; CurrentRating_mA: 50A; PositionCount: 1; SizeX_mm: 7.8; SizeY_mm: 3.5; SizeArea_mm2: 27.3; VDC_V: 12V; SizeAreaWB_mm2: 53.9; PartNumber: 1188E-1K2-V-TR; ComponentLink1Description: Datasheet URL; LatestRevisionDate: 2017-03-09; ComponentLink1URL: http://www.dip.com.tw/en/en-product-information/en-switch004/item/download/1976_b080c057386714e3a6604cbe658b9df3; CompType: Switch; PackageReference: 7.8x3.5mm; SizeZ_mm: 3.5; Publisher: Texas Instruments; Circuit: SPST; RoHS: Y; Orientation: Side Actuated; MountType: SMT